# EAGLE design kl26z (EAGLE 6.5.0)
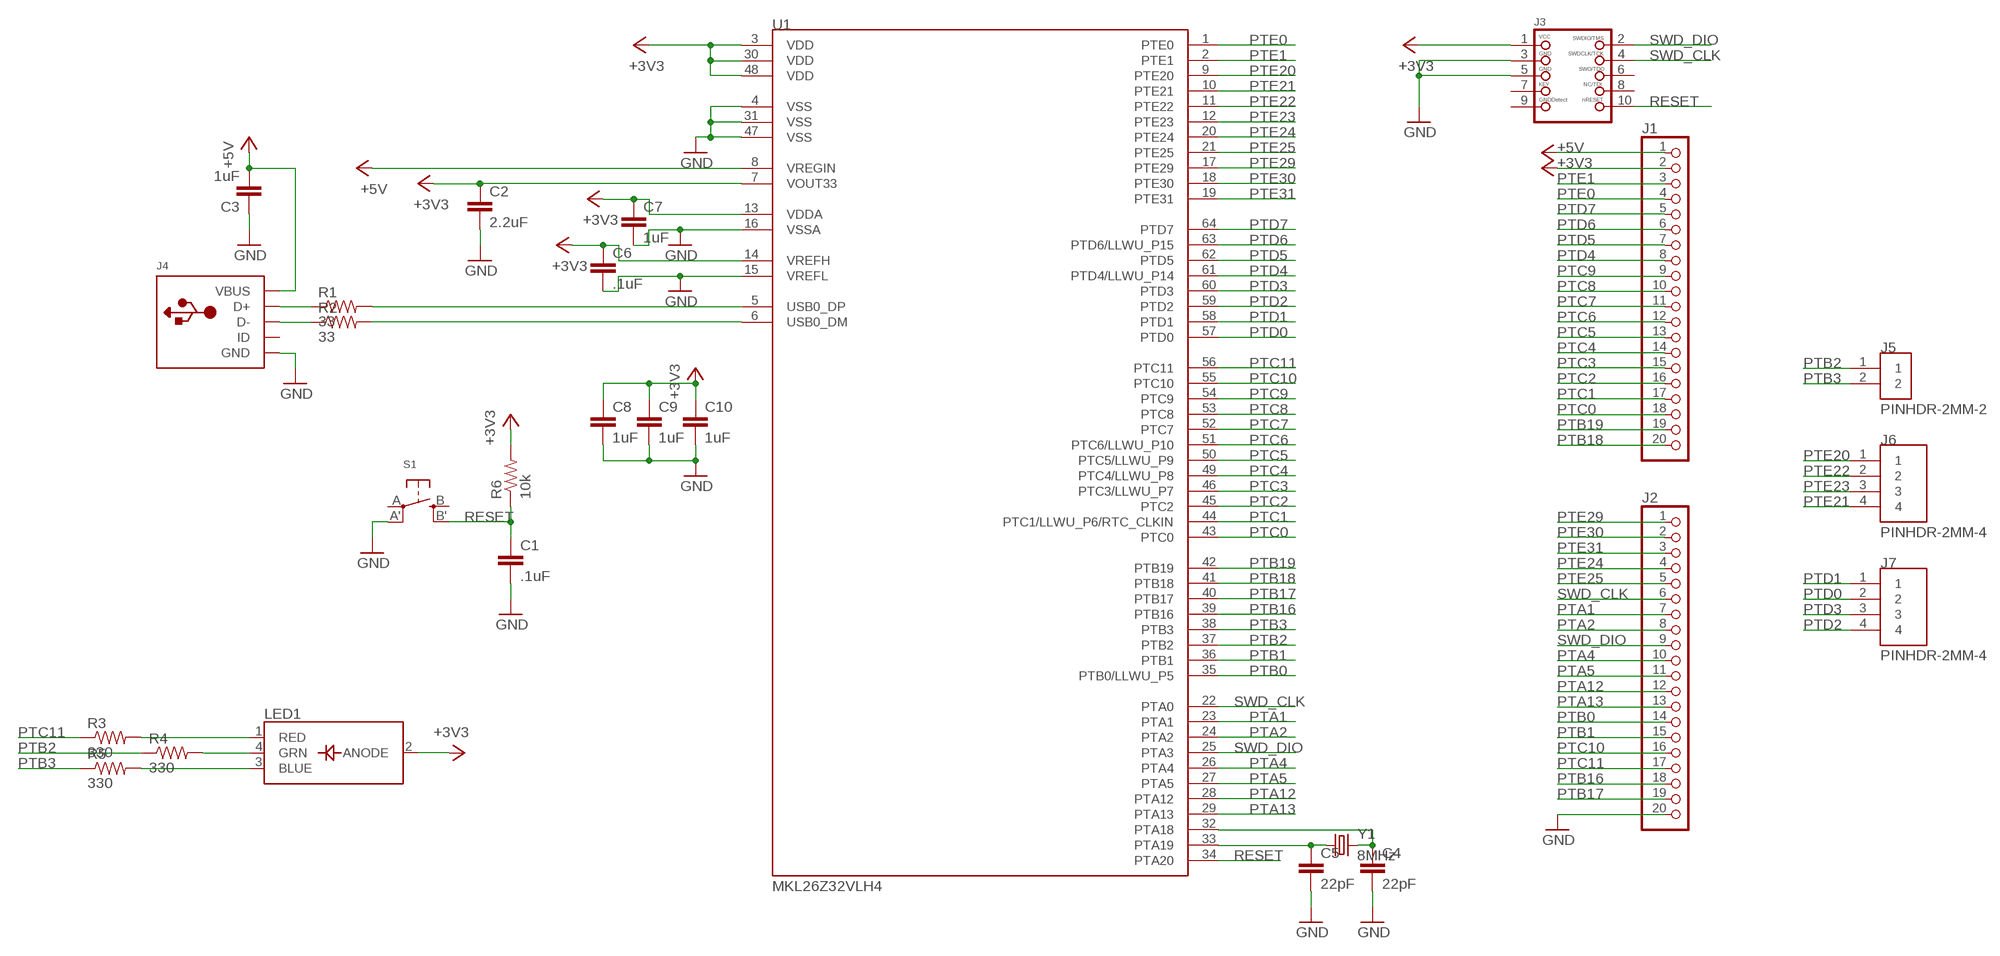
[diagram p0: schematic, sheet 1]

## Parts
C1  .1uF  C-EUC0603  [C0603]
C2  2.2uF  C-EUC0603  [C0603]
C3  1uF  C-EUC0603  [C0603]
C4  22pF  C-EUC0603  [C0603]
C5  22pF  C-EUC0603  [C0603]
C6  .1uF  C-EUC0603  [C0603]
C7  1uF  C-EUC0603  [C0603]
C8  1uF  C-EUC0603  [C0603]
C9  1uF  C-EUC0603  [C0603]
C10  1uF  C-EUC0603  [C0603]
J1  HEADER-1X20ROUND  [1X20_ROUND]
J2  HEADER-1X20ROUND  [1X20_ROUND]
J3  JTAG-CORTEXM3  [2X05_1.27MM_SMT]
J4  USBMINIB  [USB-MINIB]
J5  PINHDR-2MM-2  [PINHDR-2MM-2]
J6  PINHDR-2MM-4  [PINHDR-2MM-4]
J7  PINHDR-2MM-4  [PINHDR-2MM-4]
LED1  LED_RGB_PLCC4  [RGBLED_PLCC4]
R1  33  R-US_R0603  [R0603]
R2  33  R-US_R0603  [R0603]
R3  330  R-US_R0603  [R0603]
R4  330  R-US_R0603  [R0603]
R5  330  R-US_R0603  [R0603]
R6  10k  R-US_R0603  [R0603]
S1  SWITCH_TACT_SMT4.6X2.8  [BTN_KMR2_4.6X2.8]
U1  MKL26Z32VLH4  [LFQP64]
Y1  8MHz  CRYSTALCTS406  [CTS406]

## Nets
+3V3: C2.1 C6.1 C7.1 C8.1 C9.1 C10.1 J1.2 J3.1 LED1.2(ANODE) R6.2 U1.3(VDD) U1.7(VOUT33) U1.13(VDDA) U1.14(VREFH) U1.30(VDD) U1.48(VDD)
+5V: C3.2 J1.1 J4.VBUS U1.8(VREGIN)
GND: C1.2 C2.2 C3.1 C4.2 C5.2 C6.2 C7.2 C8.2 C9.2 C10.2 J2.20 J3.3 J3.5 J4.GND S1.A'(P1) U1.4(VSS) U1.15(VREFL) U1.16(VSSA) U1.31(VSS) U1.47(VSS)
N$3: J4.D+ R1.1
N$4: J4.D- R2.1
N$5: R1.2 U1.5(USB0_DP)
N$6: R2.2 U1.6(USB0_DM)
N$7: C5.1 U1.33(PTA19) Y1.1
N$8: C4.1 U1.32(PTA18) Y1.3
N$14: LED1.1(RED) R3.2
N$15: LED1.4(GRN) R4.2
N$16: LED1.3(BLUE) R5.2
PTA1: J2.7 U1.23(PTA1)
PTA2: J2.8 U1.24(PTA2)
PTA4: J2.10 U1.26(PTA4)
PTA5: J2.11 U1.27(PTA5)
PTA12: J2.12 U1.28(PTA12)
PTA13: J2.13 U1.29(PTA13)
PTB0: J2.14 U1.35(PTB0/LLWU_P5)
PTB1: J2.15 U1.36(PTB1)
PTB2: J5.1 R4.1 U1.37(PTB2)
PTB3: J5.2 R5.1 U1.38(PTB3)
PTB16: J2.18 U1.39(PTB16)
PTB17: J2.19 U1.40(PTB17)
PTB18: J1.20 U1.41(PTB18)
PTB19: J1.19 U1.42(PTB19)
PTC0: J1.18 U1.43(PTC0)
PTC1: J1.17 U1.44(PTC1/LLWU_P6/RTC_CLKIN)
PTC2: J1.16 U1.45(PTC2)
PTC3: J1.15 U1.46(PTC3/LLWU_P7)
PTC4: J1.14 U1.49(PTC4/LLWU_P8)
PTC5: J1.13 U1.50(PTC5/LLWU_P9)
PTC6: J1.12 U1.51(PTC6/LLWU_P10)
PTC7: J1.11 U1.52(PTC7)
PTC8: J1.10 U1.53(PTC8)
PTC9: J1.9 U1.54(PTC9)
PTC10: J2.16 U1.55(PTC10)
PTC11: J2.17 R3.1 U1.56(PTC11)
PTD0: J7.2 U1.57(PTD0)
PTD1: J7.1 U1.58(PTD1)
PTD2: J7.4 U1.59(PTD2)
PTD3: J7.3 U1.60(PTD3)
PTD4: J1.8 U1.61(PTD4/LLWU_P14)
PTD5: J1.7 U1.62(PTD5)
PTD6: J1.6 U1.63(PTD6/LLWU_P15)
PTD7: J1.5 U1.64(PTD7)
PTE0: J1.4 U1.1(PTE0)
PTE1: J1.3 U1.2(PTE1)
PTE20: J6.1 U1.9(PTE20)
PTE21: J6.4 U1.10(PTE21)
PTE22: J6.2 U1.11(PTE22)
PTE23: J6.3 U1.12(PTE23)
PTE24: J2.4 U1.20(PTE24)
PTE25: J2.5 U1.21(PTE25)
PTE29: J2.1 U1.17(PTE29)
PTE30: J2.2 U1.18(PTE30)
PTE31: J2.3 U1.19(PTE31)
RESET: C1.1 J3.10 R6.1 S1.B'(S1) U1.34(PTA20)
SWD_CLK: J2.6 J3.4 U1.22(PTA0)
SWD_DIO: J2.9 J3.2 U1.25(PTA3)
Unconnected: J3.6 J3.7 J3.8 J3.9 J4.ID S1.A(P) S1.B(S)

## Library data of the parts
C1-C10 = rcl:C-EU: CAPACITOR, European symbol
J1 J2 = microbuilder:HEADER-1X20
J3 = microbuilder:JTAG-CORTEXM3: Serial Wire (SW-DP) Connector This standard 0.05" 10-pin connector is for use with the Cortex M0/M3's native SWD (serial wire debugger) interface (SW-DP). Some boards support a 20-pin combined JTAG+SWD connector (SWJ-DP), such as the LPC1700 family, but many smaller devices only work with SWD which typically use the smaller 10-pin SW-DP connecter (the LPC1300 family, for example, only supports SWD). 2x05 1.27mm/0.05" Connector: This is the standard SMT connector defined by ARM for all Cortex devices, and should be used in most situations and for forward-compatibility since any new devices coming to market will likely use this connector. MOLEX 10 Pin 0.1" Connector: This 0.1" 10 pin connector has the same pin layout as the standard 0.05" connector, but is easier to work with if you are using standard jumper wires or custom cables to connect your SWD hardware. MOLEX 20 Pin 0.1" Connector: This 0.1" 20 pin connector is the same model used for ARM7/ARM9 JTAG debuggers, but is connected to match the pins on the Segger J-Link for ARM (which supports both JTAG and SWD debugging). See the following document from ARM for more information on Cortex M3 Debug Connectors: http://infocenter.arm.com/help/topic/com.arm.doc.faqs/attached/13634/cortex_debug_connectors.pdf And the following page for an overview with images of the different connector types: http://www.keil.com/peripherals/coresight/connectors.asp
J4 = microbuilder:USB: USB Connectors USBMINIB - Surface Mount Female Mini-B USB Connector 4UConnector: 06564
J5 = mkl26z32:PINHDR-2MM-2
J6 J7 = mkl26z32:PINHDR-2MM-4
LED1 = microbuilder:LED_RGB_PLCC4: RGB LED - PLCC4 Cree 20mA Common Anode Digikey: CLV1A-FKB-CJ1M1F1BB7R4S3CT-ND Red: 2.6V Vf, 550mcd Green: 3.2V Vf, 850mcd Blue: 3.2V Vf, 320mcd
R1-R6 = rcl:R-US_: RESISTOR, American symbol
S1 = microbuilder:SWITCH_TACT_SMT: SMT Tact Switches 6x6mm - Digikey: P12940SCT-ND KMR2 (4.6x2.8mm) - Digikey: 401-1426-1-ND EVQ-PQHB55 - Light Touch, 160GF (4.5x4.5mm) - Digikey: P8090SCT-ND
U1 = mkl26z32:MKL26Z32VLH4
Y1 = crystal:CRYSTAL: CRYSTAL; OC_FARNELL: unknown; OC_NEWARK: unknown

## Board
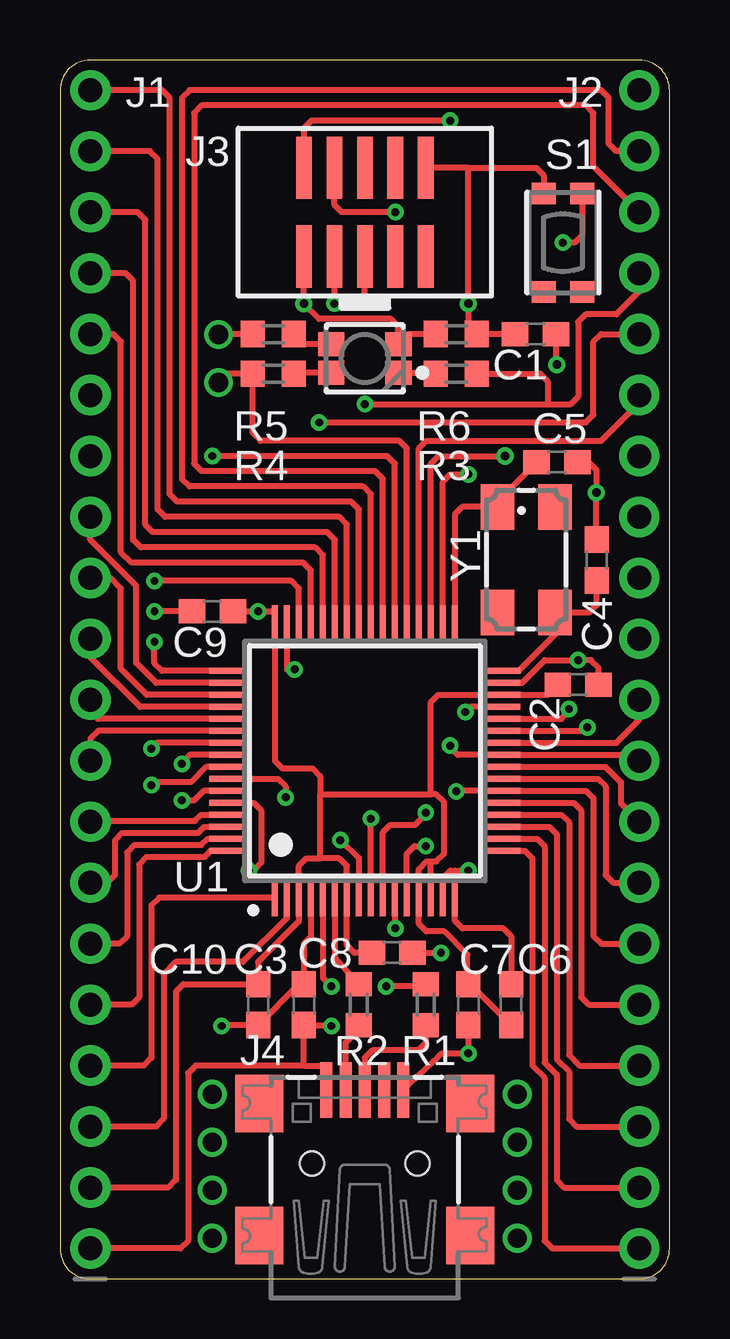
[diagram p1: board, top side]
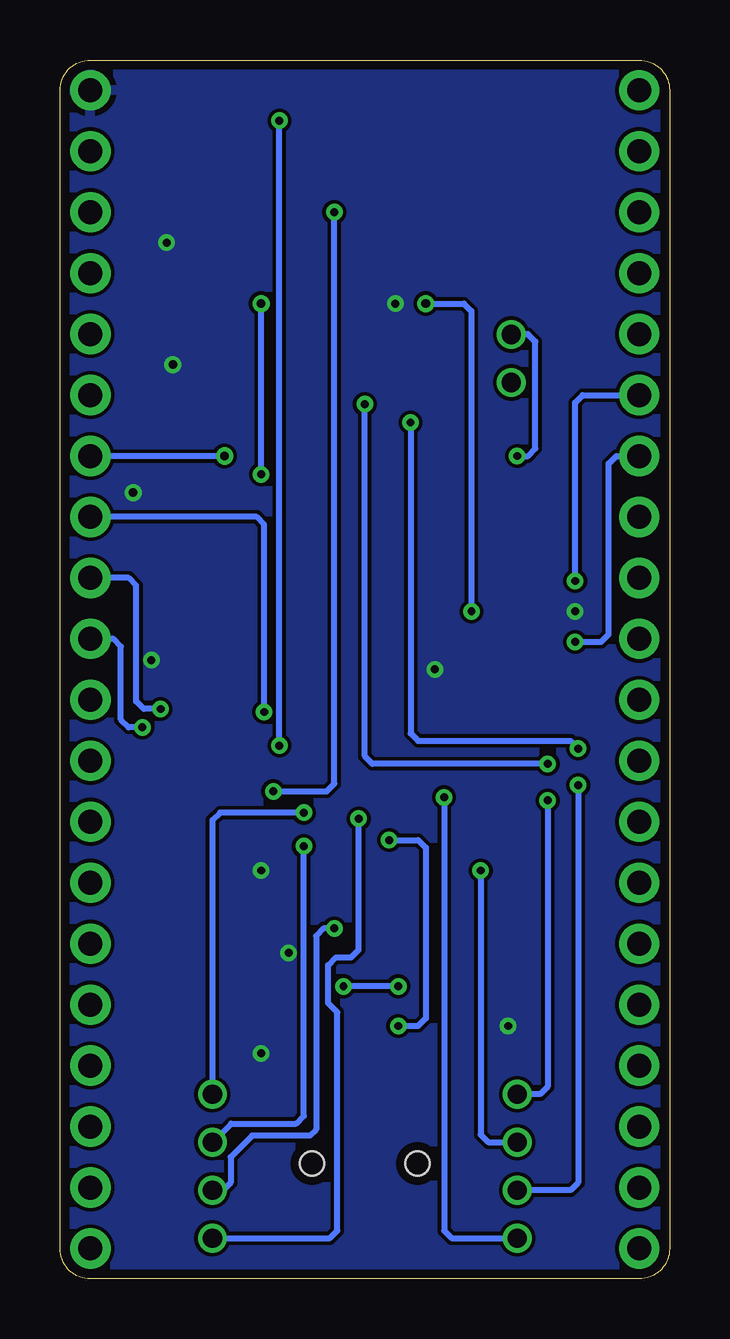
[diagram p2: board, bottom side, seen from below]

Size 25.4 x 50.79 mm. Coordinates in mm from the lower left corner, seen from the top.
Outline: 0,49.52 0,1.27 arc90 1.27,0 24.13,0 arc90 25.4,1.27 25.4,49.52 arc90 24.13,50.79 1.27,50.79 arc90 0,49.52
Copper layers (1*16): Top 0.0356mm / dielectric 1.5011mm / Bottom 0.0356mm
Design rules "LaenPCBOrder *": minimum track width 6mil, minimum drill 13mil, track to track 6mil, track to pad 6mil, pad to pad 6mil, via to via 6mil, smd to smd 6mil, copper to edge 15mil, drill to drill 6mil, minimum pad ring 7mil, minimum via ring 7mil, stop-mask expansion 3mil, vias tented up to drill 20mil, thermal gap 10mil

### Footprints (pad centres in the part's own frame; a part is rotated, then mirrored left to right if it is on the bottom)
C0603 = smd 1.1 x 1: 1 -0.85,0; 2 0.85,0
1X20_ROUND = drill 1 pad 1.676: 1 -24.13,0; 2 -21.59,0; 3 -19.05,0; 4 -16.51,0; 5 -13.97,0; 6 -11.43,0; 7 -8.89,0; 8 -6.35,0; 9 -3.81,0; 10 -1.27,0; 11 1.27,0; 12 3.81,0; 13 6.35,0; 14 8.89,0; 15 11.43,0; 16 13.97,0; 17 16.51,0; 18 19.05,0; 19 21.59,0; 20 24.13,0
2X05_1.27MM_SMT = smd 0.65 x 2.6: 1 -2.54,-1.85; 2 -2.54,1.85; 3 -1.27,-1.85; 4 -1.27,1.85; 5 0,-1.85; 6 0,1.85; 7 1.27,-1.85; 8 1.27,1.85; 9 2.54,-1.85; 10 2.54,1.85
USB-MINIB = smd 0.5 x 2.308: D+ 0,4.064; D- -0.8,4.064; GND 1.6,4.064; ID 0.8,4.064; VBUS -1.6,4.064 | smd 2 x 2.4: GND1 -4.4,-2; GND2 -4.4,3.5; GND3 4.4,3.5; GND4 4.4,-2 | hole 1: -2.2,1; 2.2,1
PINHDR-2MM-2 = drill 0.8: 1 0,1; 2 0,-1
PINHDR-2MM-4 = drill 0.8: 1 0,3; 2 0,1; 3 0,-1; 4 0,-3
RGBLED_PLCC4 = smd 1.1 x 1: 1 -1.4,0.6; 2 -1.4,-0.6; 3 1.4,-0.6; 4 1.4,0.6
R0603 = smd 1 x 1.1: 1 -0.85,0; 2 0.85,0
BTN_KMR2_4.6X2.8 = smd 0.9 x 1: A 2.05,0.8; A' -2.05,0.8; B 2.05,-0.8; B' -2.05,-0.8
LFQP64 = smd 1.55 x 0.25: 1 -5.7,3.75; 2 -5.7,3.25; 3 -5.7,2.75; 4 -5.7,2.25; 5 -5.7,1.75; 6 -5.7,1.25; 7 -5.7,0.75; 8 -5.7,0.25; 9 -5.7,-0.25; 10 -5.7,-0.75; 11 -5.7,-1.25; 12 -5.7,-1.75; 13 -5.7,-2.25; 14 -5.7,-2.75; 15 -5.7,-3.25; 16 -5.7,-3.75; 33 5.7,-3.75; 34 5.7,-3.25; 35 5.7,-2.75; 36 5.7,-2.25; 37 5.7,-1.75; 38 5.7,-1.25; 39 5.7,-0.75; 40 5.7,-0.25; 41 5.7,0.25; 42 5.7,0.75; 43 5.7,1.25; 44 5.7,1.75; 45 5.7,2.25; 46 5.7,2.75; 47 5.7,3.25; 48 5.7,3.75 | smd 0.25 x 1.55: 17 -3.75,-5.7; 18 -3.25,-5.7; 19 -2.75,-5.7; 20 -2.25,-5.7; 21 -1.75,-5.7; 22 -1.25,-5.7; 23 -0.75,-5.7; 24 -0.25,-5.7; 25 0.25,-5.7; 26 0.75,-5.7; 27 1.25,-5.7; 28 1.75,-5.7; 29 2.25,-5.7; 30 2.75,-5.7; 31 3.25,-5.7; 32 3.75,-5.7; 49 3.75,5.7; 50 3.25,5.7; 51 2.75,5.7; 52 2.25,5.7; 53 1.75,5.7; 54 1.25,5.7; 55 0.75,5.7; 56 0.25,5.7; 57 -0.25,5.7; 58 -0.75,5.7; 59 -1.25,5.7; 60 -1.75,5.7; 61 -2.25,5.7; 62 -2.75,5.7; 63 -3.25,5.7; 64 -3.75,5.7
CTS406 = smd 1.9 x 1.4: 1 -2.2,-1.2; 2 2.2,-1.2; 3 2.2,1.2; 4 -2.2,1.2

### Placement (x,y rotation side)
C1  19.81,39.37 0 top
C2  21.59,24.77 0 top
C3  10.16,11.43 270 top
C4  22.37,29.95 90 top
C5  20.71,34.03 0 top
C6  18.8,11.43 90 top
C7  17.02,11.43 270 top
C8  13.84,13.59 0 top
C9  6.35,27.81 180 top
C10  8.26,11.43 270 top
J1  1.27,25.4 90 top
J2  24.13,25.4 90 top
J3  12.7,44.45 0 top
J4  12.7,3.81 0 top
J5  6.6,38.35 180 top
J6  19.05,4.7 180 top
J7  6.35,4.7 180 top
LED1  12.7,38.35 180 top
R1  15.24,11.43 90 top
R2  12.45,11.43 90 top
R3  16.51,37.72 180 top
R4  8.89,37.72 0 top
R5  8.89,39.37 0 top
R6  16.51,39.37 180 top
S1  20.95,43.18 270 top
U1  12.7,21.59 90 top
Y1  19.43,29.97 270 top

### Tracks (layer width: path | path; a pad name or v marks a point on that pad's centre or on a via)
+3V3  (via drill 0.33, 0.36)
  Top 0.254: 15.45,20.19 15.45,24.02 15.77,24.34 U1.30 20.32,24.34 C2.1 | 10.84,17.53 10.84,20.19 | 10.84,20.19 15.45,20.19 | J3.1 v10.16,40.64 10.79,40.01 13.78,40.01 14.1,39.69 LED1.2 14.52,39.37 R6.2 | C10.1 8.26,12.57 | C10.1 5.14,12.28 4.83,11.96 4.83,4.13 4.51,3.81 J1.2 | 10.84,20.19 10.84,20.95 10.52,21.27 9.27,21.27 8.95,21.59 U1.48 8.95,27.81 v8.26,27.81 C9.1 | C10.1 8.26,13.21 9.95,14.9 U1.3 9.95,17.21 10.27,17.53 10.84,17.53 | 10.84,17.53 11.63,17.53 11.95,17.21 U1.7 11.95,13.91 12.27,13.59 C8.1 | 15.45,17.4 15.27,17.4 14.95,17.08 U1.13 14.95,14.8 15.27,14.48 16,14.48 16.97,13.51 16.97,12.28 C7.1 17.1,12.28 C6.1 | 15.45,17.4 15.68,17.4 16,17.72 16,19.88 15.68,20.19 15.45,20.19 | U1.14 15.45,17.4
  Bottom 0.254: v8.26,27.81 8.26,40.32 8.57,40.64 v10.16,40.64
+5V  (via drill 0.33)
  Top 0.254: 10.16,8.89 C3.2 11.3,10.58 v11.3,10.54 | v11.68,18.29 12.45,17.53 U1.8 | 10.16,8.89 5.65,8.89 5.33,8.57 5.33,1.59 5.02,1.27 J1.1 | 10.16,8.89 11.1,8.89 J4.VBUS
  Bottom 0.254: v11.3,10.54 10.48,10.54 10.16,10.86 10.16,17.97 10.48,18.29 v11.68,18.29
GND  (via drill 0.33, 0.33 pad 0.51, 0.36)
  Top 0.254: C9.2 v3.94,27.81 | S1.A' 21.75,43.5 21.44,43.18 v20.95,43.18 | J3.3 v11.43,40.64 12.38,40.64 12.7,40.96 J3.5 | J4.GND 15.57,9.08 15.89,9.4 v17.02,9.4 C7.2 | C6.2 18.8,14.29 18.48,14.61 16.77,14.61 16.45,14.92 U1.16 16.45,17.02 | C8.2 v15.88,13.59 | v6.73,10.54 6.73,10.58 C10.2 9.96,12.28 C3.1 10.16,13.97 10.45,14.26 U1.4 | U1.47 9.45,25.4 v9.78,25.4 | U1.31 19.25,24.84 20.19,25.78 v21.59,25.78 22.12,25.78 22.44,25.46 C2.2 | U1.15 15.95,16.7 16.27,17.02 16.45,17.02 | 16.45,17.02 v17.02,17.02 | C1.2 20.66,38.1 v20.7,38.1 | C4.2 22.35,30.8 v22.35,32.77 22.35,33.71 22.04,34.03 C5.2
  pour Bottom: 0,0 25.4,0 25.4,50.8 0,50.8
N$3
  Top 0.254: R1.1 15.24,9.84 14.92,9.53 13.02,9.53 12.7,9.21 J4.D+
N$4
  Top 0.254: J4.D- 11.9,9.84 12.22,10.16 12.38,10.16 12.7,10.48 R2.1
N$5  (via drill 0.33)
  Top 0.254: R1.2 15.24,12.19 v13.59,12.19 | U1.5 10.95,12.54 v11.3,12.19
  Bottom 0.254: v11.3,12.19 v13.59,12.19
N$6
  Top 0.254: 12.72,12.28 R2.2 11.45,13.4 U1.6
N$7
  Top 0.254: U1.33 16.45,31.86 16.77,32.17 Y1.1 18.23,32.4 C5.1
N$8
  Top 0.254: U1.32 19.12,25.34 20.63,26.85 Y1.3 22.05,27.77 22.37,28.09 C4.1
N$14
  Top 0.254: LED1.1 15.66,37.75 R3.2
N$15
  Top 0.254: LED1.4 10.06,37.75 9.74,37.44 R4.2
N$16
  Top 0.254: LED1.3 9.96,38.95 R5.2
PTA1
  Top 0.254: U1.23 22.42,20.84 22.73,20.52 22.73,16.83 23.05,16.51 J2.7
PTA2
  Top 0.254: U1.24 22.73,21.34 23.37,20.7 23.37,19.81 J2.8
PTA4
  Top 0.254: U1.26 23.18,22.34 24.13,23.29 J2.10
PTA5  (via drill 0.33 pad 0.51)
  Top 0.254: U1.27 21.82,22.84 v21.97,22.99
  Bottom 0.254: v21.97,22.99 22.54,22.99 22.86,23.3 22.86,26.35 23.18,26.67 J2.11
PTA12  (via drill 0.33 pad 0.51)
  Top 0.254: U1.28 20.89,23.34 21.21,23.66 v21.21,23.75
  Bottom 0.254: v21.21,23.75 21.91,23.75 22.23,24.07 22.23,28.89 22.54,29.21 J2.12
PTA13  (via drill 0.33 pad 0.51)
  Top 0.254: U1.29 17.11,23.84 v16.89,23.62
  Bottom 0.254: v16.89,23.62 16.89,31.43 17.21,31.75 J2.13
PTB0  (via drill 0.36)
  Top 0.254: U1.35 15.45,33.97 15.77,34.29 v18.54,34.29
  Bottom 0.254: v18.54,34.29 J2.14
PTB1
  Top 0.254: U1.36 14.95,34.61 15.27,34.92 22.54,34.92 24.13,36.51 J2.15
PTB2
  Top 0.254: U1.37 14.45,34.61 14.13,34.92 8.36,34.92 8.04,35.24 R4.1 6.92,37.72 6.6,37.4 J5.1
PTB3  (via drill 0.33 pad 0.51)
  Top 0.254: U1.38 13.95,33.97 13.63,34.29 v6.35,34.29 | R5.1 6.6,39.37 J5.2
  Bottom 0.254: v6.35,34.29 5.91,34.29 5.59,34.61 5.59,39.05 5.91,39.37 6.6,39.37 J5.2
PTB16
  Top 0.254: U1.39 13.45,33.34 13.13,33.66 5.91,33.66 5.59,33.97 5.59,48.58 5.91,48.9 21.91,48.9 22.23,48.58 22.23,46.35 J2.18
PTB17
  Top 0.254: U1.40 12.95,32.7 12.63,33.02 5.4,33.02 5.08,33.34 5.08,49.21 5.4,49.53 22.54,49.53 22.86,49.21 22.86,47.31 23.18,46.99 J2.19
PTB18
  Top 0.254: U1.41 12.45,32.07 12.13,32.38 4.89,32.38 4.57,32.7 4.57,49.21 4.25,49.53 J1.20
PTB19
  Top 0.254: U1.42 11.95,31.43 11.63,31.75 4.38,31.75 4.06,32.07 4.06,46.67 3.75,46.99 J1.19
PTC0
  Top 0.254: U1.43 11.45,30.8 11.13,31.11 3.87,31.11 3.56,31.43 3.56,44.13 3.24,44.45 J1.18
PTC1
  Top 0.254: U1.44 10.95,30.16 10.63,30.48 3.37,30.48 3.05,30.8 3.05,41.59 2.73,41.91 J1.17
PTC2
  Top 0.254: U1.45 10.45,29.53 10.13,29.84 2.98,29.84 2.54,30.29 2.54,39.05 2.22,39.37 J1.16
PTC3  (via drill 0.33)
  Top 0.254: U1.46 9.95,28.77 9.63,29.08 v3.94,29.08
  Bottom 0.254: v3.94,29.08 3.94,36.51 3.62,36.83 J1.15
PTC4  (via drill 0.33)
  Top 0.254: U1.49 4.25,25.34 3.94,25.66 v3.94,26.54
  Bottom 0.254: v3.94,26.54 2.86,26.54 2.54,26.86 2.54,33.97 2.22,34.29 J1.14
PTC5
  Top 0.254: U1.50 4,24.84 3.17,25.67 3.17,28.89 1.27,30.8 J1.13
PTC6
  Top 0.254: U1.51 3.62,24.34 2.54,25.42 2.54,28.77 2.1,29.21 J1.12
PTC7
  Top 0.254: U1.52 3.34,23.84 1.27,25.91 J1.11
PTC8
  Top 0.254: U1.53 1.59,23.34 1.27,23.66 J1.10
PTC9
  Top 0.254: U1.54 1.59,22.84 1.27,22.52 J1.9
PTC10  (via drill 0.33)
  Top 0.254: U1.55 4,22.34 3.81,22.15 v3.81,22.1 | v10.79,35.69 21.91,35.69 22.23,36.01 22.23,39.05 22.54,39.37 J2.16
  Bottom 0.254: v10.79,35.69 10.79,22.73 10.48,22.42 4.13,22.42 v3.81,22.1
PTC11  (via drill 0.33)
  Top 0.254: U1.56 5.4,21.84 5.08,21.52 v5.08,21.46 | v12.7,36.45 20.32,36.45 | 20.32,36.45 21.27,36.45 21.59,36.77 21.59,39.88 21.91,40.2 23.18,40.2 24.13,41.15 J2.17 | R3.1 20,37.72 20.32,37.4 20.32,36.45
  Bottom 0.254: v5.08,21.46 12.38,21.46 12.7,21.78 v12.7,36.45
PTD0  (via drill 0.33)
  Top 0.254: U1.57 6.99,21.34 6.1,21.34 5.46,20.7 3.94,20.7 v3.81,20.57
  Bottom 0.254: v3.81,20.57 3.81,4.02 4.13,3.7 J7.2
PTD1  (via drill 0.33)
  Top 0.254: U1.58 9.08,20.84 9.4,20.52 v9.4,20.07
  Bottom 0.254: v9.4,20.07 9.4,2.02 9.08,1.7 J7.1
PTD2  (via drill 0.33)
  Top 0.254: v5.08,19.94 5.59,19.94 5.99,20.34 U1.59
  Bottom 0.254: v5.08,19.94 5.08,8.02 5.4,7.7 J7.4
PTD3  (via drill 0.33)
  Top 0.254: U1.60 8.06,19.84 8.38,19.52 8.38,17.34 8.06,17.02 v7.87,17.02
  Bottom 0.254: v7.87,17.02 7.94,17.02 7.87,16.7 7.87,6.02 7.56,5.7 J7.3
PTD4
  Top 0.254: U1.61 5.88,19.34 5.62,19.09 1.27,19.09 J1.8
PTD5
  Top 0.254: U1.62 6.01,18.84 5.76,18.59 2.6,18.59 2.29,18.27 2.29,16.83 1.97,16.51 J1.7
PTD6
  Top 0.254: J1.6 2.48,13.97 2.79,14.29 2.79,17.77 3.11,18.09 5.89,18.09 6.15,18.34 U1.63
PTD7
  Top 0.254: U1.64 6.28,17.84 6.03,17.59 3.62,17.59 3.3,17.27 3.3,11.75 2.98,11.43 J1.5
PTE0
  Top 0.254: J1.4 3.49,8.89 3.81,9.21 3.81,15.57 4.13,15.89 U1.1
PTE1
  Top 0.254: U1.2 9.45,15.04 7.62,13.21 4.83,13.21 4.32,12.7 4.32,6.67 4,6.35 J1.3
PTE20  (via drill 0.33 pad 0.51)
  Top 0.254: U1.9 v12.95,19.17 v12.95,19.18
  Bottom 0.254: J6.1 14.16,1.7 13.84,2.02 13.84,11.11 14.22,11.49 14.22,13.08 13.91,13.4 13.27,13.4 12.95,13.72 v12.95,19.18
PTE21  (via drill 0.33 pad 0.51)
  Top 0.254: U1.10 13.45,18.61 13.77,18.92 14.8,18.92 15.24,19.37 v15.24,19.43
  Bottom 0.254: v15.24,19.43 18.73,19.43 19.05,19.11 19.05,8.02 19.11,7.7 J6.4
PTE22  (via drill 0.33 pad 0.51)
  Top 0.254: U1.11 13.95,14.61 v13.97,14.61
  Bottom 0.254: v13.97,14.61 14.41,14.61 14.73,14.29 14.73,6.22 14.99,5.97 17.4,5.97 18.29,5.08 18.29,4.02 18.61,3.7 J6.2
PTE23  (via drill 0.33)
  Top 0.254: U1.12 14.45,17.72 14.77,18.03 v15.24,18.03
  Bottom 0.254: v15.24,18.03 15.24,6.79 15.56,6.48 18.27,6.48 J6.3
PTE24
  Top 0.254: U1.20 20.89,19.34 21.21,19.02 21.21,9.34 21.65,8.89 J2.4
PTE25
  Top 0.254: U1.21 21.4,19.84 21.72,19.52 21.72,11.75 22.04,11.43 J2.5
PTE29
  Top 0.254: U1.17 19.37,17.84 19.68,17.52 19.68,8.89 20.19,8.38 20.19,1.59 20.51,1.27 J2.1
PTE30
  Top 0.254: U1.18 19.88,18.34 20.19,18.02 20.19,9.02 20.7,8.51 20.7,4.13 21.02,3.81 J2.2
PTE31
  Top 0.254: U1.19 20.38,18.84 20.7,18.52 20.7,9.14 21.21,8.64 21.21,6.67 21.53,6.35 J2.3
RESET  (via drill 0.33, 0.36)
  Top 0.254: U1.34 15.95,33.21 16.27,33.53 v17.02,33.53 | 17.02,46.3 J3.10 | 17.02,46.3 v17.02,40.64 17.02,39.37 R6.1 C1.1 | 17.02,46.3 19.84,46.3 20.16,45.98 S1.B'
  Bottom 0.254: v17.02,33.53 v17.02,40.64
SWD_CLK  (via drill 0.33)
  Top 0.254: v16.51,20.32 16.51,20.34 U1.22 21.91,20.34 22.23,20.02 22.23,14.29 22.54,13.97 J2.6 | v13.97,44.45 11.75,44.45 11.43,44.77 J3.4
  Bottom 0.254: v16.51,20.32 14.29,20.32 13.97,20.64 v13.97,44.45
SWD_DIO  (via drill 0.33)
  Top 0.254: v16.26,22.23 16.26,22.16 16.57,21.84 U1.25 24.13,21.84 J2.9 | v16.26,48.26 10.48,48.26 10.16,47.94 J3.2
  Bottom 0.254: v16.26,22.23 v16.26,48.26